# Altium schematic sheet Power.SchDoc
size 292 x 193 mm; Author: Power Lin; DocumentNumber: 1; SheetNumber: 2; SheetTotal: 4; Website: wiki-power.com
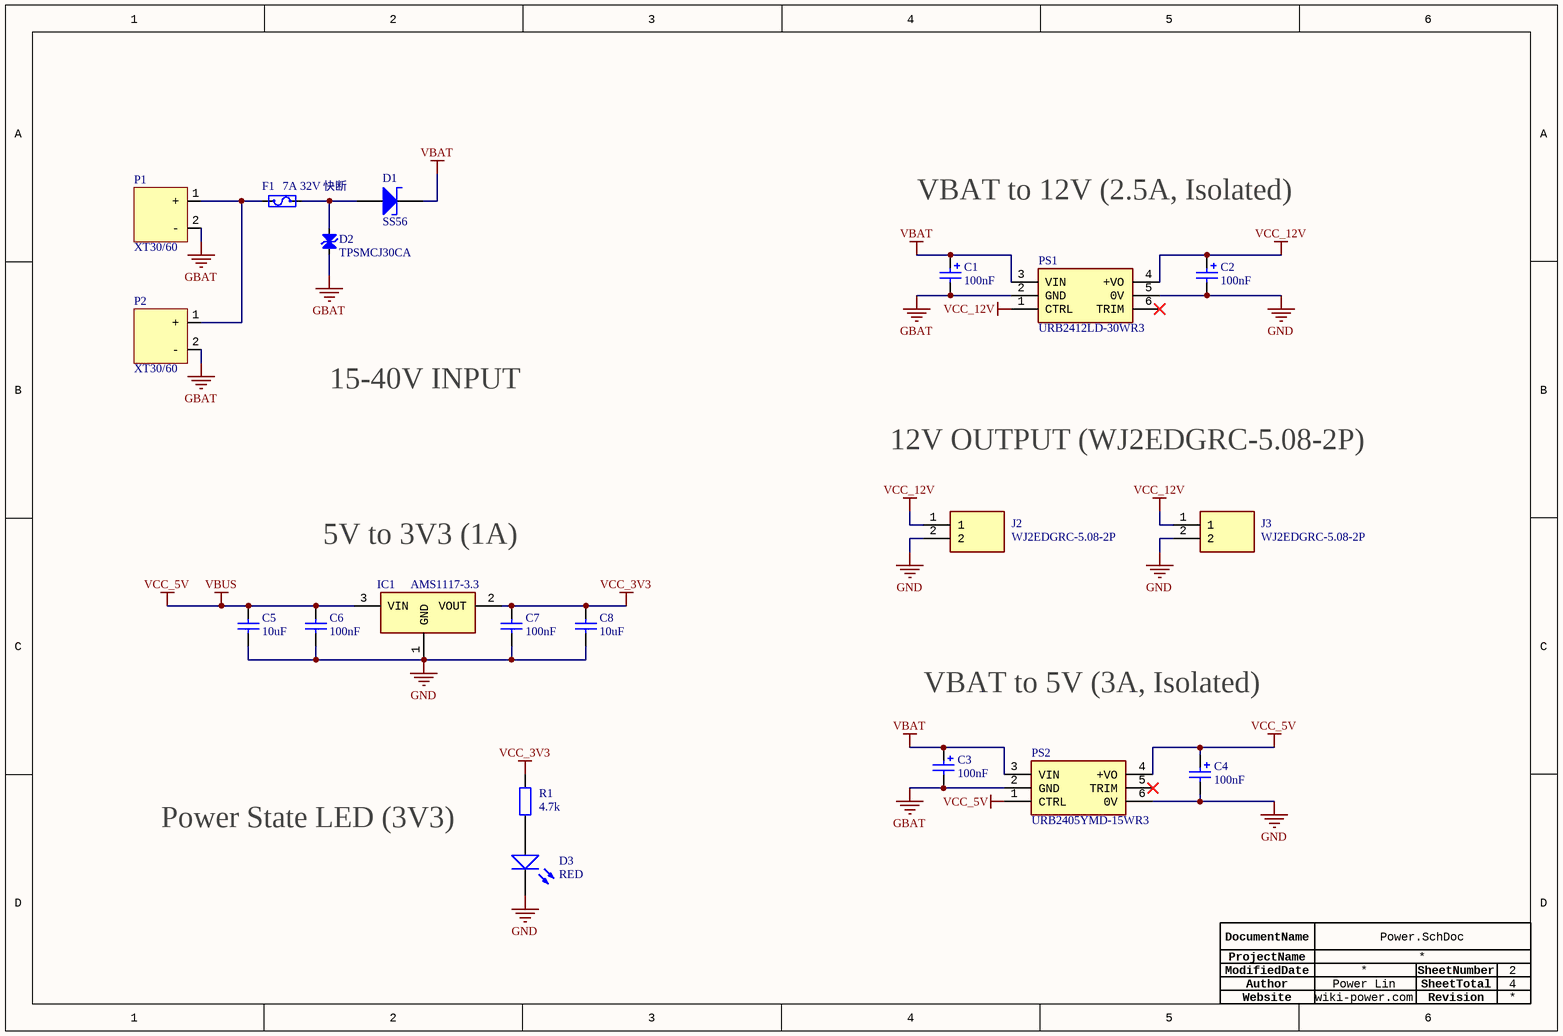
[diagram p0: Power.SchDoc]

## Parts
C1  100nF  [CAP-AUX-3216]
C2  100nF  [CAP-AUX-3216]
C3  100nF  [CAP-AUX-3216]
C4  100nF  [CAP-AUX-3216]
C5  10uF  [CAP-0603]
C6  100nF  [CAP-0603]
C7  100nF  [CAP-0603]
C8  10uF  [CAP-0603]
D1  SS56  [DO-214AB/SMC]
D2  TPSMCJ30CA  [DO-214AB/SMC]
D3  RED  [LED-0603]
F1  7A 32V 快断  [FUSE_1206]
IC1  AMS1117-3.3  [SOT-223]
J2  WJ2EDGRC-5.08-2P  [SHDRRA2W105P0X508_1X2_1206X1220X830P]
J3  WJ2EDGRC-5.08-2P  [SHDRRA2W105P0X508_1X2_1206X1220X830P]
P1  XT30/60  [XT60PW-M]
P2  XT30/60  [XT60PW-M]
PS1  URB2412LD-30WR3  [URB2412LD30WR3]
PS2  URB2405YMD-15WR3  [URB2405YMD15WR3]
R1  4.7k  [R-0603]

## Nets
GBAT: C1.2 C3.2 D2.1 P1.2(-) P2.2(-) PS1.2(GND) PS2.2(GND)
GND: C2.2 C4.2 C5.1 C6.1 C7.1 C8.1 D3.K IC1.1(GND) J2.2 J3.2 PS1.5(0V) PS2.6(0V)
VBAT: C1.1 C3.1 D1.2(K) PS1.3(VIN) PS2.3(VIN)
VBUS: C4.1 C5.2 C6.2 IC1.3(VIN) PS2.1(CTRL) PS2.4(+VO)  [also labelled VCC_5V]
VCC_3V3: C7.2 C8.2 IC1.2(VOUT) R1.2
VCC_12V: C2.1 J2.1 J3.1 PS1.1(CTRL) PS1.4(+VO)
NetD1_1: D1.1(A) D2.2 F1.2
NetD3_A: D3.A R1.1
NetF1_1: F1.1 P1.1(+) P2.1(+)

Not connected (* = marked no-connect by the designer): PS1 6(TRIM)*; PS2 5(TRIM)*

## Notes on the sheet
- VBAT to 12V (2.5A, Isolated)
- 15-40V INPUT
- 12V OUTPUT (WJ2EDGRC-5.08-2P)
- 5V to 3V3 (1A)
- VBAT to 5V (3A, Isolated)
- Power State LED (3V3)
- Author
- DocumentName
- ModifiedDate
- ProjectName
- SheetNumber
- SheetTotal
- Website
- Revision

## Library data of the parts
C1-C4 = CAP-POL: KM101M050F115A; ComponentLink1Description: 供应商链接; ComponentLink1URL: http://www.szlcsc.com/product/details_16815.html; Package: 3528; Supplier: LC; SuppliersPartNumber: C16133
C5-C8 = CAP: 贴片电容; ComponentLink1Description: 供应商链接; ComponentLink1URL: http://www.szlcsc.com/product/details_53938.html; Package: 0402; Supplier: LC; SuppliersPartNumber: C52923
D1 = DIODE_Schottky: 肖特基二极管
D2 = TVS_C
D3 = LED: 发光二极管; pin to pad: A>1 K>2; ComponentLink1Description: 供应商链接; ComponentLink1URL: http://www.szlcsc.com/product/details_2663.html; Package: 0603; Supplier: LC; SuppliersPartNumber: C2290
F1 = Fuse: 0437007.WR
IC1 = AMS1117: AMS1117-3.3 1.0A; Manufacturer_Name: Nexperia; Manufacturer_Part_Number: SI2302DS; Datasheet Link: https://assets.nexperia.com/documents/data-sheet/SI2302DS.pdf; Height: 1.1mm; Mouser Part Number: N/A; Mouser Price/Stock: https://www.mouser.com/Search/Refine.aspx?Keyword=N%2FA; RS Part Number: 7983053P; RS Price/Stock: http://uk.rs-online.com/web/p/products/7983053P
J2 J3 = WJ2EDGRC-5.08-2P: Connector; Manufacturer_Name: Ningbo Kangnex; Description: Pluggable System Terminal Block 2P RoHS; Datasheet Link: https://datasheet.lcsc.com/szlcsc/Ningbo-Kangnex-Elec-WJ2EDGRC-5-08-2P_C3697.pdf; Height: 8.3mm; Manufacturer_Part_Number: WJ2EDGRC-5.08-2P
PS1 = URB2412LD-30WR3: 金升阳隔离电源; Manufacturer_Name: Mornsun; Manufacturer_Part_Number: URB2412LD-30WHR3; Datasheet Link: https://4donline.ihs.com/images/VipMasterIC/IC/MNSN/MNSN-S-A0002273855/MNSN-S-A0002273855-1.pdf?hkey=EF798316E3902B6ED9A73243A3159BB0; Height: 16.8mm
PS2 = URB2405YMD-15WR3: 金升阳隔离电源; Manufacturer_Name: Mornsun; Manufacturer_Part_Number: URB2405YMD-10WR3; Datasheet Link: https://www.mornsun-power.com/html/pdf/URB2405YMD-10WR3.html; Height: 12.2mm
R1 = RES: 贴片电阻; Package: 0805; Supplier: LC; SuppliersPartNumber: C17798